# EAGLE schematic schematic (EAGLE 6.5.0)
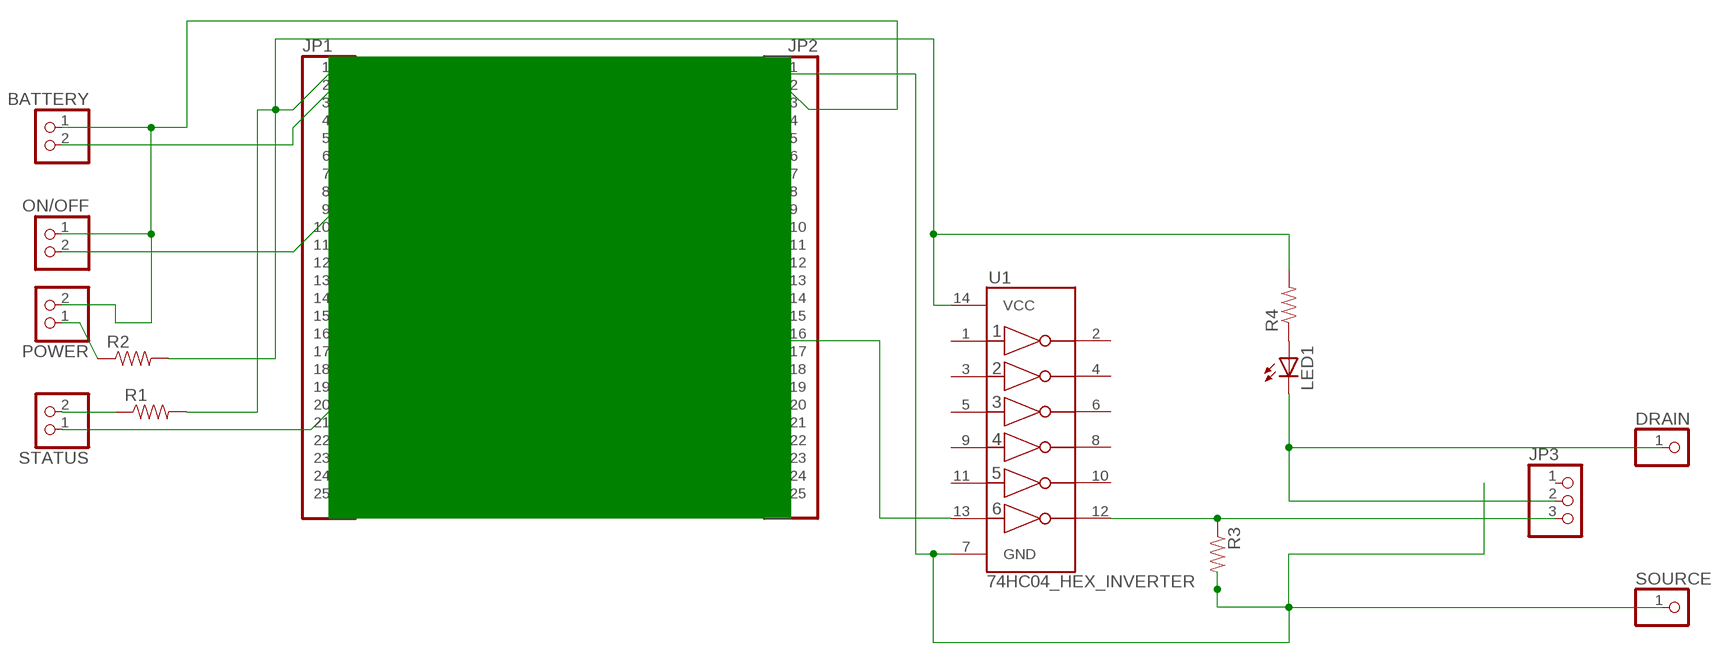
[diagram p0: schematic, sheet 1]

## Parts
BATTERY  PINHD-1X2  [1X02]
DRAIN  PINHD-1X1  [1X01]
JP1  PINHD-1X25  [1X25]
JP2  PINHD-1X25  [1X25]
JP3  PINHD-1X3  [1X03]
LED1  LED-3MM-NO_SILK  [LED3MM-NS]
ON/OFF  PINHD-1X2  [1X02]
POWER  PINHD-1X2  [1X02]
R1  RESISTORKIT  [AXIAL-0.3-KIT]
R2  RESISTORKIT  [AXIAL-0.3-KIT]
R3  RESISTORKIT  [AXIAL-0.3-KIT]
R4  RESISTORKIT  [AXIAL-0.3-KIT]
SOURCE  PINHD-1X1  [1X01]
STATUS  PINHD-1X2  [1X02]
U1  74HC04_HEX_INVERTER  [DIL14]

## Nets
N$1: JP1.20 STATUS.1
N$2: R1.P$1 STATUS.2
N$3: BATTERY.1 JP2.2 ON/OFF.1 POWER.2
N$4: JP1.1 R1.P$2 R2.P$2 R4.P$2 U1.14(VCC)
N$5: BATTERY.2 JP1.2
N$6: JP1.9 ON/OFF.2
N$7: JP2.16 U1.13(6A)
N$8: POWER.1 R2.P$1
N$9: JP2.1 R3.P$2 SOURCE.1 U1.7(GND)
N$12: JP3.3 R3.P$1 U1.12(6Y)
N$13: DRAIN.1 JP3.2 LED1.K(C)
N$14: LED1.A R4.P$1
Unconnected: JP1.3 JP1.4 JP1.5 JP1.6 JP1.7 JP1.8 JP1.10 JP1.11 JP1.12 JP1.13 JP1.14 JP1.15 JP1.16 JP1.17 JP1.18 JP1.19 JP1.21 JP1.22 JP1.23 JP1.24 JP1.25 JP2.3 JP2.4 JP2.5 JP2.6 JP2.7 JP2.8 JP2.9 JP2.10 JP2.11 JP2.12 JP2.13 JP2.14 JP2.15 JP2.17 JP2.18 JP2.19 JP2.20 JP2.21 JP2.22 JP2.23 JP2.24 JP2.25 JP3.1 U1.1(1A) U1.2(1Y) U1.3(2A) U1.4(2Y) U1.5(3A) U1.6(3Y) U1.8(4Y) U1.9(4A) U1.10(5Y) U1.11(5A)

## Library data of the parts
BATTERY ON/OFF POWER STATUS = pinhead:PINHD-1X2: PIN HEADER
DRAIN SOURCE = pinhead:PINHD-1X1: PIN HEADER
JP1 JP2 = pinhead:PINHD-1X25: PIN HEADER
JP3 = pinhead:PINHD-1X3: PIN HEADER
LED1 = SparkFun:LED: LEDs Standard schematic elements and footprints for 5mm, 3mm, 1206, and 0603 sized LEDs. 5mm - Spark Fun Electronics SKU : COM-00529 (and others)
R1-R4 = SparkFun:RESISTOR: Resistor Basic schematic elements and footprints for 0603, 1206, and PTH resistors.
U1 = SparkFun:74HC04_HEX_INVERTER: 74HC04 Hex Inverter